# Altium schematic sheet Chip.SchDoc
size A4; SheetNumber: 3; SheetTotal: 7
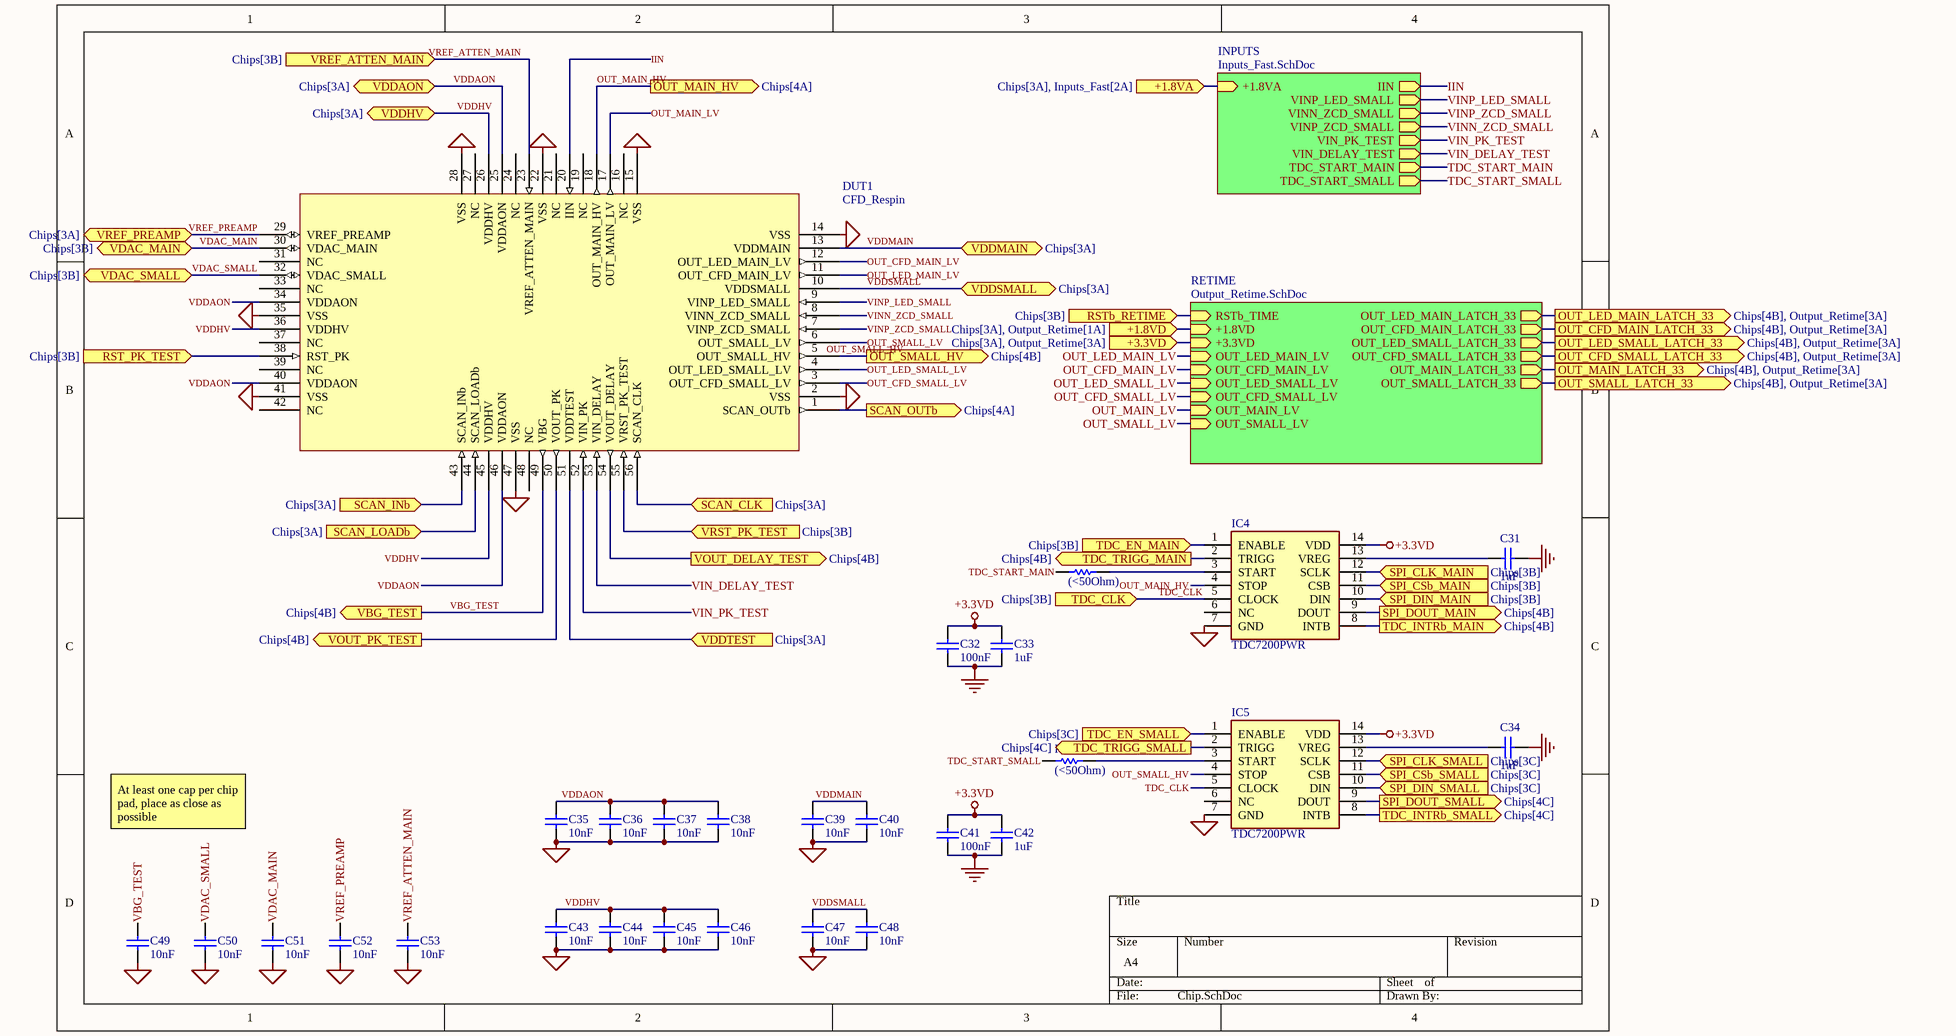
[diagram p0: Chip.SchDoc]

## Parts
C31  1uF  [CAPC1608X90X35ML10T15]
C32  100nF  [CAPC1608X90X35ML10T15]
C33  1uF  [CAPC1608X90X35ML10T15]
C34  1uF  [CAPC1608X90X35ML10T15]
C35  10nF  [CAPC1608X90X35ML10T15]
C36  10nF  [CAPC1608X90X35ML10T15]
C37  10nF  [CAPC1608X90X35ML10T15]
C38  10nF  [CAPC1608X90X35ML10T15]
C39  10nF  [CAPC1608X90X35ML10T15]
C40  10nF  [CAPC1608X90X35ML10T15]
C41  100nF  [CAPC1608X90X35ML10T15]
C42  1uF  [CAPC1608X90X35ML10T15]
C43  10nF  [CAPC1608X90X35ML10T15]
C44  10nF  [CAPC1608X90X35ML10T15]
C45  10nF  [CAPC1608X90X35ML10T15]
C46  10nF  [CAPC1608X90X35ML10T15]
C47  10nF  [CAPC1608X90X35ML10T15]
C48  10nF  [CAPC1608X90X35ML10T15]
C49  10nF  [CAPC1608X90X35ML10T15]
C50  10nF  [CAPC1608X90X35ML10T15]
C51  10nF  [CAPC1608X90X35ML10T15]
C52  10nF  [CAPC1608X90X35ML10T15]
C53  10nF  [CAPC1608X90X35ML10T15]
DUT1  CFD_Respin  [QFN50P800X800X80_HS-57N_WIDEVIAS]
IC4  TDC7200PWR  [SOP65P640X120-14N]
IC5  TDC7200PWR  [SOP65P640X120-14N]
R1  (<50Ohm)  [RESC1609X50X30NL8T20]
R2  (<50Ohm)  [RESC1609X50X30NL8T20]

## Sub-sheets
INPUTS = Inputs_Fast.SchDoc: IIN (out), VINP_LED_SMALL (out), VINN_ZCD_SMALL (out), VINP_ZCD_SMALL (out), VIN_PK_TEST (out), VIN_DELAY_TEST (out), +1.8VA (in), TDC_START_MAIN (out), TDC_START_SMALL (out)
RETIME = Output_Retime.SchDoc: RSTb_TIME (in), +1.8VD (in), +3.3VD (in), OUT_LED_MAIN_LV (in), OUT_CFD_MAIN_LV (in), OUT_LED_SMALL_LV (in), OUT_CFD_SMALL_LV (in), OUT_MAIN_LV (in), OUT_SMALL_LV (in), OUT_LED_MAIN_LATCH_33 (out), OUT_CFD_MAIN_LATCH_33 (out), OUT_LED_SMALL_LATCH_33 (out), OUT_CFD_SMALL_LATCH_33 (out), OUT_MAIN_LATCH_33 (out), OUT_SMALL_LATCH_33 (out)

## Ports
+1.8VA (in, see Chips[3A], Inputs_Fast[2A]), +1.8VD (in, see Chips[3A], Output_Retime[1A]), +3.3VD (in, see Chips[3A], Output_Retime[3A]), OUT_CFD_MAIN_LATCH_33 (out, see Chips[4B], Output_Retime[3A]), OUT_CFD_SMALL_LATCH_33 (out, see Chips[4B], Output_Retime[3A]), OUT_LED_MAIN_LATCH_33 (out, see Chips[4B], Output_Retime[3A]), OUT_LED_SMALL_LATCH_33 (out, see Chips[4B], Output_Retime[3A]), OUT_MAIN_HV (out, see Chips[4A]), OUT_MAIN_LATCH_33 (out, see Chips[4B], Output_Retime[3A]), OUT_SMALL_HV (out, see Chips[4B]), OUT_SMALL_LATCH_33 (out, see Chips[4B], Output_Retime[3A]), RST_PK_TEST (in, see Chips[3B]), RSTb_RETIME (in, see Chips[3B]), SCAN_CLK (in, see Chips[3A]), SCAN_INb (in, see Chips[3A]), SCAN_LOADb (in, see Chips[3A]), SCAN_OUTb (out, see Chips[4A]), SPI_CLK_MAIN (in, see Chips[3B]), SPI_CLK_SMALL (in, see Chips[3C]), SPI_CSb_MAIN (in, see Chips[3B]), SPI_CSb_SMALL (in, see Chips[3C]), SPI_DIN_MAIN (in, see Chips[3B]), SPI_DIN_SMALL (in, see Chips[3C]), SPI_DOUT_MAIN (out, see Chips[4B]), SPI_DOUT_SMALL (out, see Chips[4C]), TDC_CLK (in, see Chips[3B]), TDC_EN_MAIN (in, see Chips[3B]), TDC_EN_SMALL (in, see Chips[3C]), TDC_INTRb_MAIN (out, see Chips[4B]), TDC_INTRb_SMALL (out, see Chips[4C]), TDC_TRIGG_MAIN (out, see Chips[4B]), TDC_TRIGG_SMALL (out, see Chips[4C]), VBG_TEST (out, see Chips[4B]), VDAC_MAIN (bidir, see Chips[3B]), VDAC_SMALL (bidir, see Chips[3B]), VDDAON (bidir, see Chips[3A]), VDDHV (bidir, see Chips[3A]), VDDMAIN (bidir, see Chips[3A]), VDDSMALL (bidir, see Chips[3A]), VDDTEST (in, see Chips[3A]), VOUT_DELAY_TEST (out, see Chips[4B]), VOUT_PK_TEST (out, see Chips[4B]), VREF_ATTEN_MAIN (in, see Chips[3B]), VREF_PREAMP (bidir, see Chips[3A]), VRST_PK_TEST (in, see Chips[3B])

## Nets
+3.3VD: C32.1 C33.1 C41.1 C42.1 IC4.14(VDD) IC5.14(VDD)
GND: C31.2 C32.2 C33.2 C34.2 C35.1 C36.1 C37.1 C38.1 C39.1 C40.1 C41.2 C42.2 C43.1 C44.1 C45.1 C46.1 C47.1 C48.1 C49.1 C50.1 C51.1 C52.1 C53.1 DUT1.2(VSS) DUT1.14(VSS) DUT1.15(VSS) DUT1.22(VSS) DUT1.28(VSS) DUT1.35(VSS) DUT1.41(VSS) DUT1.47(VSS) IC4.7(GND) IC5.7(GND)
+1.8VA: port +1.8VA, sheet INPUTS/+1.8VA
+1.8VD: port +1.8VD, sheet RETIME/+1.8VD
+3.3VD: port +3.3VD, sheet RETIME/+3.3VD  [a separate net that carries the same name]
IIN: DUT1.20(IIN) ; sheet INPUTS/IIN
OUT_CFD_MAIN_LATCH_33: port OUT_CFD_MAIN_LATCH_33, sheet RETIME/OUT_CFD_MAIN_LATCH_33
OUT_CFD_MAIN_LV: DUT1.12(OUT_LED_MAIN_LV) ; sheet RETIME/OUT_CFD_MAIN_LV
OUT_CFD_SMALL_LATCH_33: port OUT_CFD_SMALL_LATCH_33, sheet RETIME/OUT_CFD_SMALL_LATCH_33
OUT_CFD_SMALL_LV: DUT1.3(OUT_CFD_SMALL_LV) ; sheet RETIME/OUT_CFD_SMALL_LV
OUT_LED_MAIN_LATCH_33: port OUT_LED_MAIN_LATCH_33, sheet RETIME/OUT_LED_MAIN_LATCH_33
OUT_LED_MAIN_LV: DUT1.11(OUT_CFD_MAIN_LV) ; sheet RETIME/OUT_LED_MAIN_LV
OUT_LED_SMALL_LATCH_33: port OUT_LED_SMALL_LATCH_33, sheet RETIME/OUT_LED_SMALL_LATCH_33
OUT_LED_SMALL_LV: DUT1.4(OUT_LED_SMALL_LV) ; sheet RETIME/OUT_LED_SMALL_LV
OUT_MAIN_HV: DUT1.18(OUT_MAIN_HV) IC4.4(STOP) ; port OUT_MAIN_HV
OUT_MAIN_LATCH_33: port OUT_MAIN_LATCH_33, sheet RETIME/OUT_MAIN_LATCH_33
OUT_MAIN_LV: DUT1.17(OUT_MAIN_LV) ; sheet RETIME/OUT_MAIN_LV
OUT_SMALL_HV: DUT1.5(OUT_SMALL_HV) ; port OUT_SMALL_HV
OUT_SMALL_HV: IC5.4(STOP)  [a separate net that carries the same name]
OUT_SMALL_LATCH_33: port OUT_SMALL_LATCH_33, sheet RETIME/OUT_SMALL_LATCH_33
OUT_SMALL_LV: DUT1.6(OUT_SMALL_LV) ; sheet RETIME/OUT_SMALL_LV
RST_PK_TEST: DUT1.38(RST_PK) ; port RST_PK_TEST
RSTb_RETIME: port RSTb_RETIME, sheet RETIME/RSTb_TIME
SCAN_CLK: DUT1.56(SCAN_CLK) ; port SCAN_CLK
SCAN_INb: DUT1.43(SCAN_INb) ; port SCAN_INb
SCAN_LOADb: DUT1.44(SCAN_LOADb) ; port SCAN_LOADb
SCAN_OUTb: DUT1.1(SCAN_OUTb) ; port SCAN_OUTb
SPI_CLK_MAIN: IC4.12(SCLK) ; port SPI_CLK_MAIN
SPI_CLK_SMALL: IC5.12(SCLK) ; port SPI_CLK_SMALL
SPI_CSb_MAIN: IC4.11(CSB) ; port SPI_CSb_MAIN
SPI_CSb_SMALL: IC5.11(CSB) ; port SPI_CSb_SMALL
SPI_DIN_MAIN: IC4.10(DIN) ; port SPI_DIN_MAIN
SPI_DIN_SMALL: IC5.10(DIN) ; port SPI_DIN_SMALL
SPI_DOUT_MAIN: IC4.9(DOUT) ; port SPI_DOUT_MAIN
SPI_DOUT_SMALL: IC5.9(DOUT) ; port SPI_DOUT_SMALL
TDC_CLK: IC4.5(CLOCK) IC5.5(CLOCK) ; port TDC_CLK
TDC_EN_MAIN: IC4.1(ENABLE) ; port TDC_EN_MAIN
TDC_EN_SMALL: IC5.1(ENABLE) ; port TDC_EN_SMALL
TDC_INTRb_MAIN: IC4.8(INTB) ; port TDC_INTRb_MAIN
TDC_INTRb_SMALL: IC5.8(INTB) ; port TDC_INTRb_SMALL
TDC_START_MAIN: R1.1 ; sheet INPUTS/TDC_START_MAIN
TDC_START_SMALL: R2.1 ; sheet INPUTS/TDC_START_SMALL
TDC_TRIGG_MAIN: IC4.2(TRIGG) ; port TDC_TRIGG_MAIN
TDC_TRIGG_SMALL: IC5.2(TRIGG) ; port TDC_TRIGG_SMALL
VBG_TEST: C49.2 DUT1.49(VBG) ; port VBG_TEST
VDAC_MAIN: C51.2 DUT1.30(VDAC_MAIN) ; port VDAC_MAIN
VDAC_SMALL: C50.2 DUT1.32(VDAC_SMALL) ; port VDAC_SMALL
VDDAON: C35.2 C36.2 C37.2 C38.2 DUT1.25(VDDAON) DUT1.34(VDDAON) DUT1.40(VDDAON) DUT1.46(VDDAON) ; port VDDAON
VDDHV: C43.2 C44.2 C45.2 C46.2 DUT1.26(VDDHV) DUT1.36(VDDHV) DUT1.45(VDDHV) ; port VDDHV
VDDMAIN: C39.2 C40.2 DUT1.13(VDDMAIN) ; port VDDMAIN
VDDSMALL: C47.2 C48.2 DUT1.10(VDDSMALL) ; port VDDSMALL
VDDTEST: DUT1.51(VDDTEST) ; port VDDTEST
VIN_DELAY_TEST: DUT1.53(VIN_DELAY) ; sheet INPUTS/VIN_DELAY_TEST
VIN_PK_TEST: DUT1.52(VIN_PK) ; sheet INPUTS/VIN_PK_TEST
VINN_ZCD_SMALL: DUT1.8(VINN_ZCD_SMALL) ; sheet INPUTS/VINP_ZCD_SMALL
VINP_LED_SMALL: DUT1.9(VINP_LED_SMALL) ; sheet INPUTS/VINP_LED_SMALL
VINP_ZCD_SMALL: DUT1.7(VINP_ZCD_SMALL) ; sheet INPUTS/VINN_ZCD_SMALL
VOUT_DELAY_TEST: DUT1.54(VOUT_DELAY) ; port VOUT_DELAY_TEST
VOUT_PK_TEST: DUT1.50(VOUT_PK) ; port VOUT_PK_TEST
VREF_ATTEN_MAIN: C53.2 DUT1.23(VREF_ATTEN_MAIN) ; port VREF_ATTEN_MAIN
VREF_PREAMP: C52.2 DUT1.29(VREF_PREAMP) ; port VREF_PREAMP
VRST_PK_TEST: DUT1.55(VRST_PK_TEST) ; port VRST_PK_TEST
NetC31_1: C31.1 IC4.13(VREG)
NetC34_1: C34.1 IC5.13(VREG)
NetIC4_3: IC4.3(START) R1.2
NetIC5_3: IC5.3(START) R2.2

Not connected (* = marked no-connect by the designer): DUT1 16(NC) 19(NC) 21(NC) 24(NC) 27(NC) 31(NC) 33(NC) 37(NC) 39(NC) 42(NC) 48(NC); IC4 6(NC); IC5 6(NC)

## Notes on the sheet
- At least one cap per chip pad, place as close as possible
- Labels drawn without touching a wire or pin: OUT_SMALL_HV

## Library data of the parts
C31-C53 = CMP-2000-04945-1: 0603; Manufacturer: Murata; Capacitance: 22pF; Tolerance (%): ±5%; Rated Voltage: 50V; Dielectric: C0G; Manufacturer URL: http://www.murata.com/; Datasheet Version: Jul-06; Package Reference: 603; Case Size/Dimension: 0603; Package Description: 2-Pin Surface Mount Device, Body 1.6 x 0.8 mm; Datasheet URL: https://datasheet.ciiva.com/11786/0900766b807a1cab-11786398.pdf
IC4 IC5 = TDC7200PWR: Integrated Circuit; Manufacturer_Name: Texas Instruments; Datasheet Link: http://www.ti.com/lit/gpn/tdc7200; Height: 1.2mm; Manufacturer_Part_Number: TDC7200PWR
R1 R2 = CMP-2000-03816-5: 0603; Manufacturer: Vishay Semiconductor; Voltage Rating: 75 V; Package Quantity: 5000; DatasheetVersion: 06/2012; Min Operating Temperature: -55 degC; ComponentLink1URL: http://www.vishay.com/; Mounting Technology: Surface Mount; Height: 0.45 mm; ComponentLink1Description: Manufacturer URL; REACH SVHC: Unknown; PackageReference: 0603; Packaging: Tape and Reel; Max Operating Temperature: 155 degC; Mount: Surface Mount; ComponentLink2Description: Datasheet; PackageDescription: 2-Pin Surface Mount Device, Body 1.575 x 0.85 mm; Length: 1.55 mm; ComponentLink2URL: http://www.vishay.com/docs/20035/dcrcwe3.pdf; Pins: 2; RoHSCompliant: true